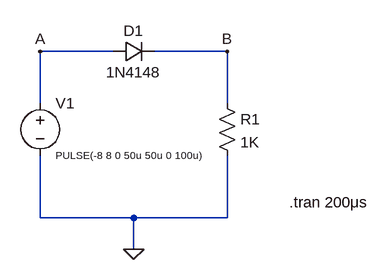
[diagram p0: schematic 1.1.1.asc]
1.1.1.asc, the LTspice schematic file:
Version 4
SHEET 1 880 680
WIRE 144 80 32 80
WIRE 320 80 208 80
WIRE 32 160 32 80
WIRE 320 160 320 80
WIRE 32 336 32 240
WIRE 176 336 32 336
WIRE 320 336 320 240
WIRE 320 336 176 336
WIRE 176 384 176 336
FLAG 176 384 0
FLAG 32 80 A
FLAG 320 80 B
SYMBOL diode 144 96 R270
WINDOW 0 32 32 VTop 2
WINDOW 3 0 32 VBottom 2
SYMATTR InstName D1
SYMATTR Value 1N4148
SYMBOL res 304 144 R0
SYMATTR InstName R1
SYMATTR Value 1K
SYMBOL voltage 32 144 R0
WINDOW 123 0 0 Left 0
WINDOW 39 0 0 Left 0
WINDOW 3 24 96 Left 1
SYMATTR Value PULSE(-8 8 0 50u 50u 0 100u)
SYMATTR InstName V1
TEXT 416 312 Left 2 !.tran 200μs

The netlist it stands for:
* 1.1.1.asc
D1 A B 1N4148
R1 B 0 1K
V1 A 0 PULSE(-8 8 0 50u 50u 0 100u)
.model D D
.lib standard.dio
.tran 200μs
.backanno
.end

* Results of the author's LTspice run, read from the files saved beside the schematic
* Operating Point, zero values left out:
*   V(a) = -8 V
*   V(b) = -3.403 V
*   I(D1) = -3.403 mA
*   I(R1) = -3.403 mA
*   I(V1) = 3.403 mA
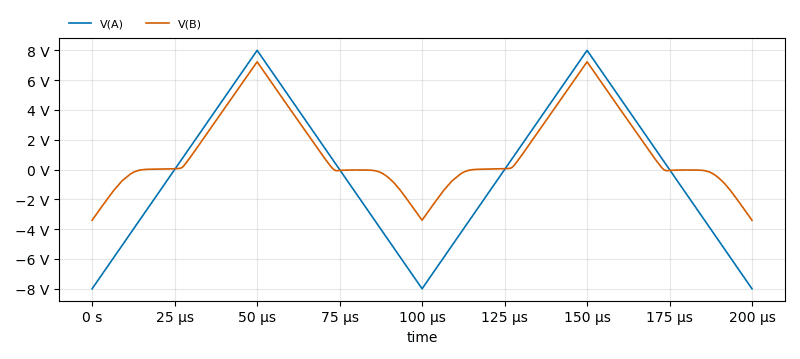
[diagram p1: Transient Analysis of 1.1.1.asc, plotted from the saved traces]
* Transient Analysis, 1 run:
*   V(A): min -8 V, max 7.994 V, average -410.1 µV, rms 4.685 V, last -8 V
*   V(B): min -3.403 V, max 7.227 V, average 1.245 V, rms 3.067 V, last -3.403 V